# EAGLE design TangPrimer_base (EAGLE 7.7.0)
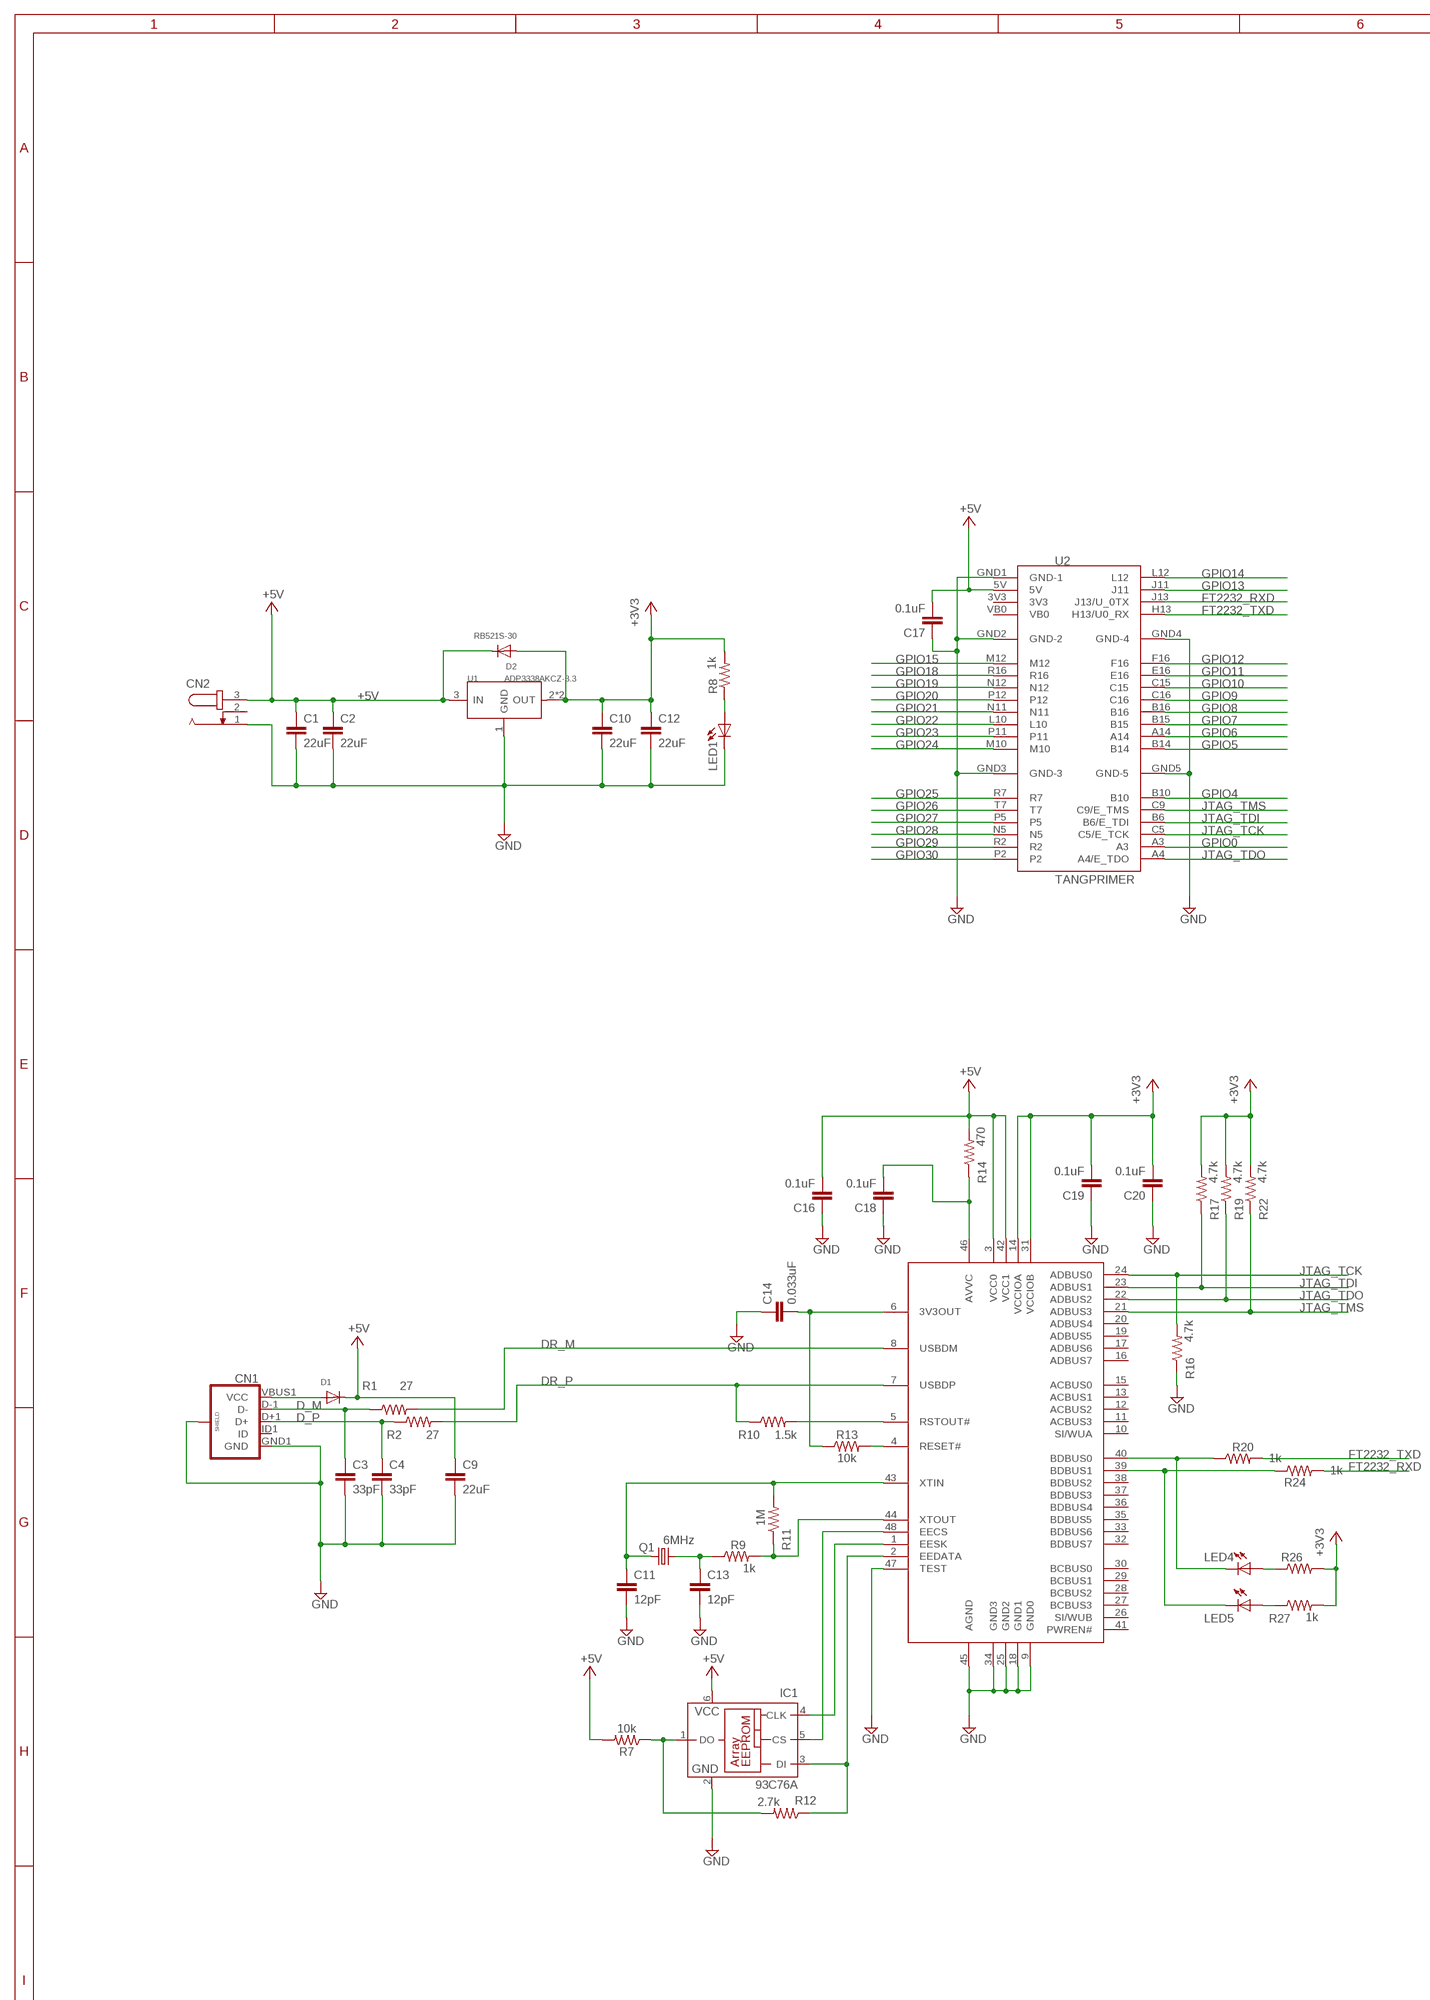
[diagram p0: schematic, sheet 1, part 1 of 2]
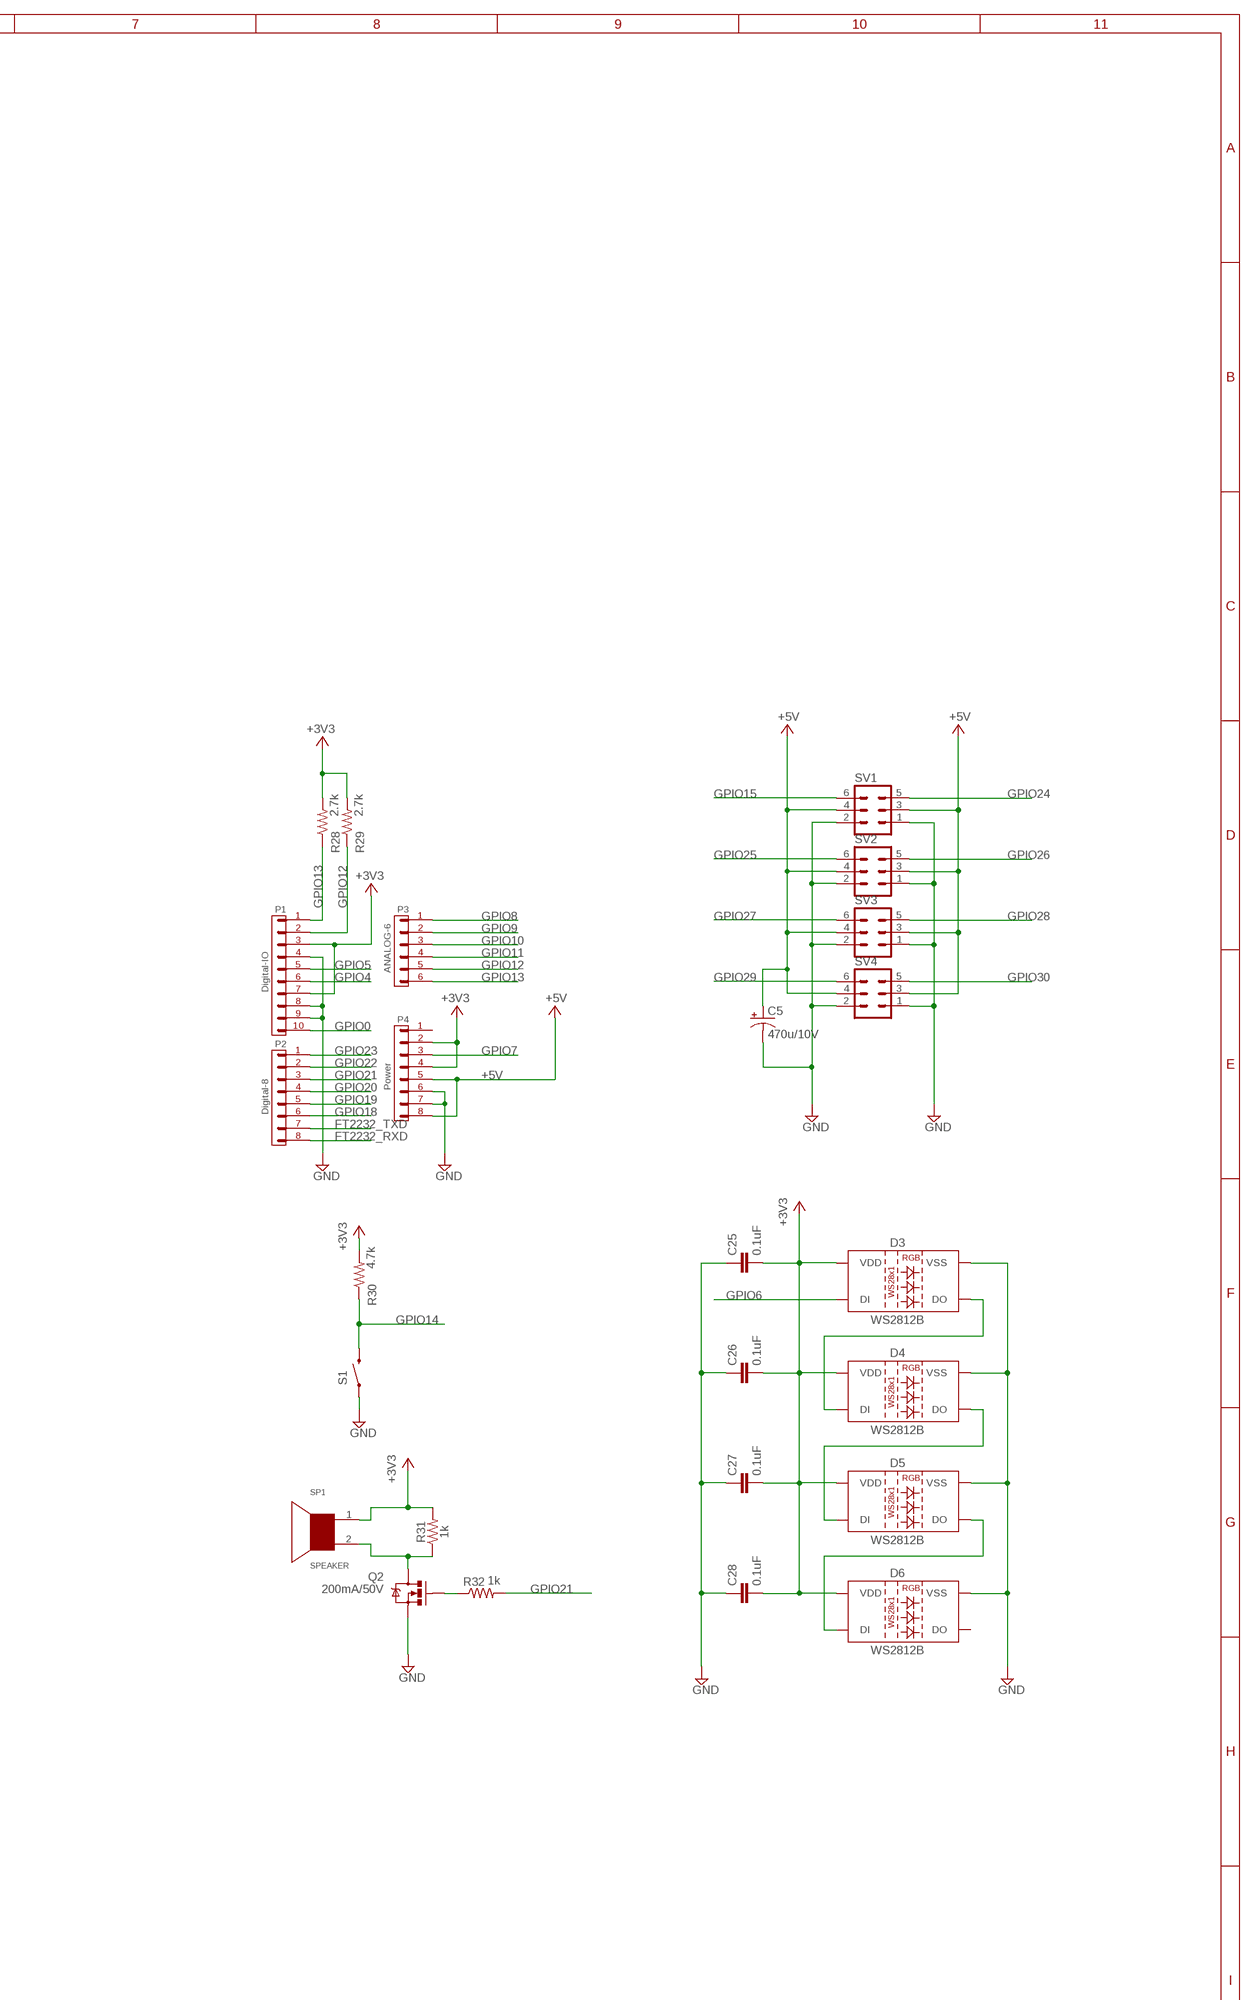
[diagram p1: schematic, sheet 1, part 2 of 2]

## Parts
C1  22uF  10UF-0603-6.3V-20%  [0603]
C2  22uF  10UF-0603-6.3V-20%  [0603]
C3  33pF  47PF-0603-50V-5%  [0603]
C4  33pF  47PF-0603-50V-5%  [0603]
C5  470u/10V  CPOL-USE2.5-7  [E2,5-7]
C9  22uF  10UF-0603-6.3V-20%  [0603]
C10  22uF  10UF-0603-6.3V-20%  [0603]
C11  12pF  47PF-0603-50V-5%  [0603]
C12  22uF  10UF-0603-6.3V-20%  [0603]
C13  12pF  47PF-0603-50V-5%  [0603]
C14  0.033uF  47PF-0603-50V-5%  [0603]
C16  0.1uF  0.1UF-0603-25V-5%  [0603]
C17  0.1uF  0.1UF-0603-25V-5%  [0603]
C18  0.1uF  0.1UF-0603-25V-5%  [0603]
C19  0.1uF  0.1UF-0603-25V-5%  [0603]
C20  0.1uF  0.1UF-0603-25V-5%  [0603]
C25  0.1uF  0.1UF-0603-25V-5%  [0603]
C26  0.1uF  0.1UF-0603-25V-5%  [0603]
C27  0.1uF  0.1UF-0603-25V-5%  [0603]
C28  0.1uF  0.1UF-0603-25V-5%  [0603]
CN1  MCUBF-09  [MCUBF-09]
CN2  JACK-PLUG0  [SPC4077]
D1  DIODE_SOD-123FL  [SOD-123FL]
D2  RB521S-30  DIODESOD-523  [SOD-523]
D3  WS2812B  WS2812_2020  [WS2812_2020]
D4  WS2812B  WS2812_2020  [WS2812_2020]
D5  WS2812B  WS2812_2020  [WS2812_2020]
D6  WS2812B  WS2812_2020  [WS2812_2020]
IC1  93C76A  [SOT23-6]
IC2  FT2232L  [LQFP48]
LED1  LEDCHIP-LED0805  [CHIP-LED0805]
LED4  LEDCHIP-LED0805  [CHIP-LED0805]
LED5  LEDCHIP-LED0805  [CHIP-LED0805]
Q1  6MHz  CRYSTALSM49  [SM49]
Q2  200mA/50V  MOSFET-NCHANNELBSS138  [SOT23-3]
R1  27  RESISTOR0603  [0603]
R2  27  RESISTOR0603  [0603]
R7  10k  RESISTOR0603  [0603]
R8  1k  RESISTOR0603  [0603]
R9  1k  RESISTOR0603  [0603]
R10  1.5k  RESISTOR0603  [0603]
R11  1M  RESISTOR0603  [0603]
R12  2.7k  RESISTOR0603  [0603]
R13  10k  RESISTOR0603  [0603]
R14  470  RESISTOR0603  [0603]
R16  4.7k  RESISTOR0603  [0603]
R17  4.7k  RESISTOR0603  [0603]
R19  4.7k  RESISTOR0603  [0603]
R20  1k  RESISTOR0603  [0603]
R22  4.7k  RESISTOR0603  [0603]
R24  1k  RESISTOR0603  [0603]
R26  1k  RESISTOR0603  [0603]
R27  1k  RESISTOR0603  [0603]
R28  2.7k  RESISTOR0603  [0603]
R29  2.7k  RESISTOR0603  [0603]
R30  4.7k  RESISTOR0603  [0603]
R31  1k  RESISTOR0603  [0603]
R32  1k  RESISTOR0603  [0603]
S1  SWITCH-MOMENTARY-2SMD-1101NE  [TACTILE-SWITCH-1101NE]
S2  TANGPRIMER_BASE  [TANGPRIMER_BASE]
SP1  SPEAKER  [SPEAKER]
SV1  MA03-2  [MA03-2]
SV2  MA03-2  [MA03-2]
SV3  MA03-2  [MA03-2]
SV4  MA03-2  [MA03-2]
U1  ADP3338AKCZ-3.3  PMIC-CJT1117-3.3(SOT223)  [SOT-223]
U2  TANGPRIMER  [TANGPRIMER]

## Nets
+3V3 [pow]: C10.1 C12.1 C19.2 C20.2 C25.2 C26.2 C27.2 C28.2 D2.A D3.4(VDD) D4.4(VDD) D5.4(VDD) D6.4(VDD) IC2.14(VCCIOA) IC2.31(VCCIOB) R8.2 R17.2 R19.2 R22.2 R26.2 R27.2 R28.2 R29.2 R30.2 R31.2 S2.3V3-1 S2.3V3-2 S2.AREF S2.D11 SP1.1 U1.2(OUT) U1.TER(OUT)
+5V [pow]: C1.1 C2.1 C5.+ C9.1 C16.2 C17.2 CN2.3 D1.C D2.K(C) IC1.6(VCC) IC2.3(VCC0) IC2.42(VCC1) R7.2 R14.2 S2.5V S2.VIN SV1.3 SV1.4 SV2.3 SV2.4 SV3.3 SV3.4 SV4.3 SV4.4 U1.3(IN) U2.5V
D_M: C3.1 CN1.D-1(D-) R1.1
D_P: C4.1 CN1.D+1(D+) R2.1
DR_M: IC2.8(USBDM) R1.2
DR_P: IC2.7(USBDP) R2.2 R10.1
FT2232_RXD: R24.2 S2.RXD(RX) U2.J13(J13/U_0TX)
FT2232_TXD: R20.2 S2.TXD(TX) U2.H13(H13/U0_RX)
GND [GND]: C1.2 C2.2 C3.2 C4.2 C5.- C9.2 C10.2 C11.2 C12.2 C13.2 C14.1 C16.1 C17.1 C18.1 C19.1 C20.1 C25.1 C26.1 C27.1 C28.1 CN1.GND1(GND) CN1.GND@1(SHIELD) CN1.GND@2(SHIELD) CN1.GND@3(SHIELD) CN1.GND@4(SHIELD) CN1.GND@5(SHIELD) CN1.GND@6(SHIELD) CN1.GND@7(SHIELD) CN1.GND@8(SHIELD) CN2.1 D3.2(VSS) D4.2(VSS) D5.2(VSS) D6.2(VSS) IC1.2(GND) IC2.9(GND0) IC2.18(GND1) IC2.25(GND2) IC2.34(GND3) IC2.45(AGND) IC2.47(TEST) LED1.C Q2.2(S) R16.1 S1.1 S2.D9 S2.D10 S2.GND-1(GND1) S2.GND-2(GND2) S2.GND-3(GND3) SV1.1 SV1.2 SV2.1 SV2.2 SV3.1 SV3.2 SV4.1 SV4.2 U1.1(GND) U2.GND1(GND-1) U2.GND2(GND-2) U2.GND3(GND-3) U2.GND4(GND-4) U2.GND5(GND-5)
GPIO0: S2.D8 U2.A3
GPIO4: S2.D12 U2.B10
GPIO5: S2.D13 U2.B14
GPIO6: D3.3(DI) U2.A14
GPIO7: S2.RESET U2.B15
GPIO8: S2.A0 U2.B16
GPIO9: S2.A1 U2.C16
GPIO10: S2.A2 U2.C15
GPIO11: S2.A3 U2.E16
GPIO12: R29.1 S2.A4 S2.SDA U2.F16
GPIO13: R28.1 S2.A5 S2.SCL U2.J11
GPIO14: R30.1 S1.2 U2.L12
GPIO15: SV1.6 U2.M12
GPIO18: S2.D2 U2.R16
GPIO19: S2.D3 U2.N12
GPIO20: S2.D4 U2.P12
GPIO21: R32.2 S2.D5 U2.N11
GPIO22: S2.D6 U2.L10
GPIO23: S2.D7 U2.P11
GPIO24: SV1.5 U2.M10
GPIO25: SV2.6 U2.R7
GPIO26: SV2.5 U2.T7
GPIO27: SV3.6 U2.P5
GPIO28: SV3.5 U2.N5
GPIO29: SV4.6 U2.R2
GPIO30: SV4.5 U2.P2
JTAG_TCK: IC2.24(ADBUS0) R16.2 U2.C5(C5/E_TCK)
JTAG_TDI: IC2.23(ADBUS1) R17.1 U2.B6(B6/E_TDI)
JTAG_TDO: IC2.22(ADBUS2) R19.1 U2.A4(A4/E_TDO)
JTAG_TMS: IC2.21(ADBUS3) R22.1 U2.C9(C9/E_TMS)
N$1 [pow]: CN1.VBUS1(VCC) D1.A
N$3: Q2.3(D) R31.1 SP1.2
N$9: IC2.5(RSTOUT#) R10.2
N$10: Q2.1(G) R32.1
N$11: IC2.4(RESET#) R13.2
N$12: LED1.A R8.1
N$13: C14.2 IC2.6(3V3OUT) R13.1
N$15: C11.1 IC2.43(XTIN) Q1.1 R11.2
N$16: IC2.44(XTOUT) R9.2 R11.1
N$17: C13.1 Q1.2 R9.1
N$22: LED4.A R26.1
N$24: LED5.A R27.1
N$25: IC1.5(CS) IC2.48(EECS)
N$26: IC1.4(CLK) IC2.1(EESK)
N$27: IC1.3(DI) IC2.2(EEDATA) R12.1
N$28: IC1.1(DO) R7.1 R12.2
N$29: D3.1(DO) D4.3(DI)
N$31: IC2.40(BDBUS0) LED4.C R20.1
N$35: D4.1(DO) D5.3(DI)
N$36: C18.2 IC2.46(AVVC) R14.1
N$37: D5.1(DO) D6.3(DI)
N$42: IC2.39(BDBUS1) LED5.C R24.1
Unconnected: CN1.ID1(ID) CN2.2 D6.1(DO) IC2.10(SI/WUA) IC2.11(ACBUS3) IC2.12(ACBUS2) IC2.13(ACBUS1) IC2.15(ACBUS0) IC2.16(ADBUS7) IC2.17(ADBUS6) IC2.19(ADBUS5) IC2.20(ADBUS4) IC2.26(SI/WUB) IC2.27(BCBUS3) IC2.28(BCBUS2) IC2.29(BCBUS1) IC2.30(BCBUS0) IC2.32(BDBUS7) IC2.33(BDBUS6) IC2.35(BDBUS5) IC2.36(BDBUS4) IC2.37(BDBUS3) IC2.38(BDBUS2) IC2.41(PWREN#) S2.RESERVED U2.3V3 U2.VB0

## Library data of the parts
C1 C2 C9 C10 C12 = SparkFun-Capacitors:10UF: 10.0µF ceramic capacitors A capacitor is a passive two-terminal electrical component used to store electrical energy temporarily in an electric field.; PROD_ID: CAP-11015; VALUE: 10uF
C3 C4 C11 C13 C14 = SparkFun-Capacitors:47PF: 47pF ceramic capacitors A capacitor is a passive two-terminal electrical component used to store electrical energy temporarily in an electric field.; PROD_ID: CAP-08913; VALUE: 47pF
C5 = resistor:CPOL-US: POLARIZED CAPACITOR, American symbol
C16-C20 C25-C28 = SparkFun-Capacitors:0.1UF: 0.1µF ceramic capacitors A capacitor is a passive two-terminal electrical component used to store electrical energy temporarily in an electric field.; PROD_ID: CAP-08604
CN1 = MCUBF:MCUBF: USB Micro-B connectors Some male, some female. Watch your step!
CN2 = con-jack:JACK-PLUG: DC POWER JACK Power Jack, DC, Right Angle, Through Hole, Rated 5A at 16VDC, PC Terminals Distributor: Farnell (www.Farnell.de) Drawing: 84N1161.pdf / 84N1162.pdf Manufacturer: SPC Technology (www.spctechnology.com) Type: SPC4077 / SPC 4078; OC_FARNELL: unknown; OC_NEWARK: unknown
D1 D2 = adafruit:DIODE: Diode SMADIODE - SMA Surface Mount Package 20V 1A Schottky Diode Digikey: 641-1014-6-ND DO-1N4148 - Through Hole Small Current Diode SOD-123 20V 1 A (.5mV Vf) Schottky Diode - Digikey: MBRX120TPMSCT-ND SOD-323 10V 570mA (.38mV Vf, 3ns) Schottky Diode - Digikey: ZLLS410CT-ND SOD-523 30V 30mA Schottky Diode (RB751S-40TE61) - Digikey: RB751S-40TE61CT-ND SOT23-R/W - SOT23 Package (R = Solder Paste/Reflow Ovens, W = Hand-Soldering) BAT54Film 40V 300mA - Digikey: 497-7162-1-ND
D3-D6 = ws2812_2020:WS2812_2020: WS2812 2020 SMD addressable RGB LED 2x2mm SMD LED with built-in controller IC.; PROD_ID: DIO-12503
IC1 = microchip:93*76?: 8K Microwire Compatible Serial EEPROM Source: http://ww1.microchip.com/downloads/en/DeviceDoc/21796H.pdf; OC_FARNELL: unknown; OC_NEWARK: unknown
IC2 = ftdichip:FT2232L: USB UART / FIFO Controller 3nd Generation USB Double-UART (USB <-> Serial) - FIFO Controller
LED1 LED4 LED5 = adafruit:LED: LED OSRAM: - CHIPLED LG R971, LG N971, LY N971, LG Q971, LY Q971, LO R971, LY R971 LH N974, LH R974 LS Q976, LO Q976, LY Q976 LO Q996 - Hyper CHIPLED LW Q18S LB Q993, LB Q99A, LB R99A - SideLED LS A670, LO A670, LY A670, LG A670, LP A670 LB A673, LV A673, LT A673, LW A673 LH A674 LY A675 LS A676, LA A676, LO A676, LY A676, LW A676 LS A679, LY A679, LG A679 - Hyper Micro SIDELED® LS Y876, LA Y876, LO Y876, LY Y876 LT Y87S - SmartLED LW L88C, LW L88S LB L89C, LB L89S, LG L890 LS L89K, LO L89K, LY L89K LS L896, LA L896, LO L896, LY L896 - TOPLED LS T670, LO T670, LY T670, LG T670, LP T670 LSG T670, LSP T670, LSY T670, LOP T670, LYG T670 LG T671, LOG T671, LSG T671 LB T673, LV T673, LT T673, LW T673 LH T674 LS T676, LA T676, LO T676, LY T676, LB T676, LH T676, LSB T676, LW T676 LB T67C, LV T67C, LT T67C, LS T67K, LO T67K, LY T67K, LW E67C LS E67B, LA E67B, LO E67B, LY E67B, LB E67C, LV E67C, LT E67C LW T67C LS T679, LY T679, LG T679 LS T770, LO T770, LY T770, LG T770, LP T770 LB T773, LV T773, LT T773, LW T773 LH T774 LS E675, LA E675, LY E675, LS T675 LS T776, LA T776, LO T776, LY T776, LB T776 LHGB T686 LT T68C, LB T68C - Hyper Mini TOPLED® LB M676 - Mini TOPLED Santana® LG M470 LS M47K, LO M47K, LY M47K Source: http://www.osram.convergy.de/
Q1 = crystal:CRYSTAL: CRYSTAL; OC_FARNELL: unknown; OC_NEWARK: unknown
Q2 = SparkFun-DiscreteSemi:MOSFET-NCHANNEL: Common NMOSFET Parts MFG P/N Store ID Prod ID FDD8780 TRANS-09984 SI7820DN TRANS-11055 FDS6630A IC-08089 2N7002PW TRANS-11151 FQP30N06L COM-10213 TRANS-10060 BSS123LT1G TRANS-08345 BSS138 TRANS-00830 BS170 2N7000; PROD_ID: TRANS-00830
R1 R2 R7-R14 R16 R17 R19 R20 R22 R24 R26-R32 = SparkFun-Resistors:RESISTOR: Generic Resistor Package
S1 = SparkFun-Electromechanical:SWITCH-MOMENTARY-2: Various NO switches- pushbuttons, reed, etc; PROD_ID: SWCH-00815
S2 = suna_lib:TANGPRIMER_BASE
SP1 = cq:SPEAKER
SV1-SV4 = con-lstb:MA03-2: PIN HEADER; OC_FARNELL: unknown; OC_NEWARK: unknown
U1 = Seeed-OPL-ic:PMIC-CJT1117-3.3(SOT223): 310030097; MPN: CJT1117-3.3; VALUE: CJT1117-3.3-SOT223
U2 = suna_lib:TANGPRIMER

## Net classes
1 pow: width 0.406 mm
2 GND: width 0.61 mm

## Board
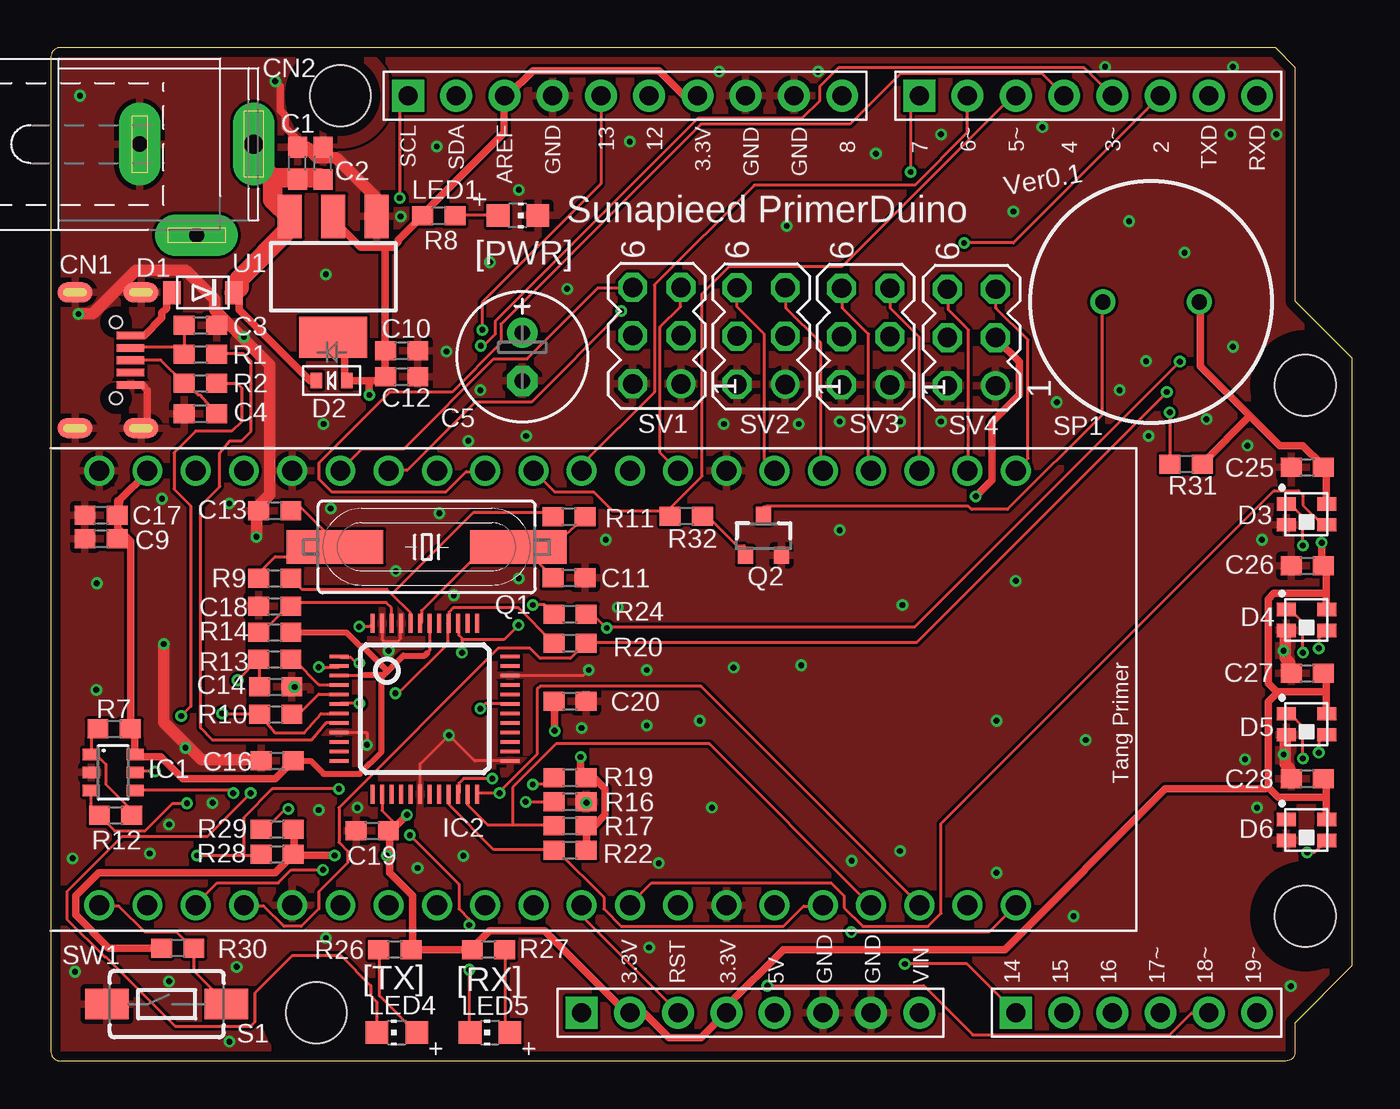
[diagram p2: board, top side]
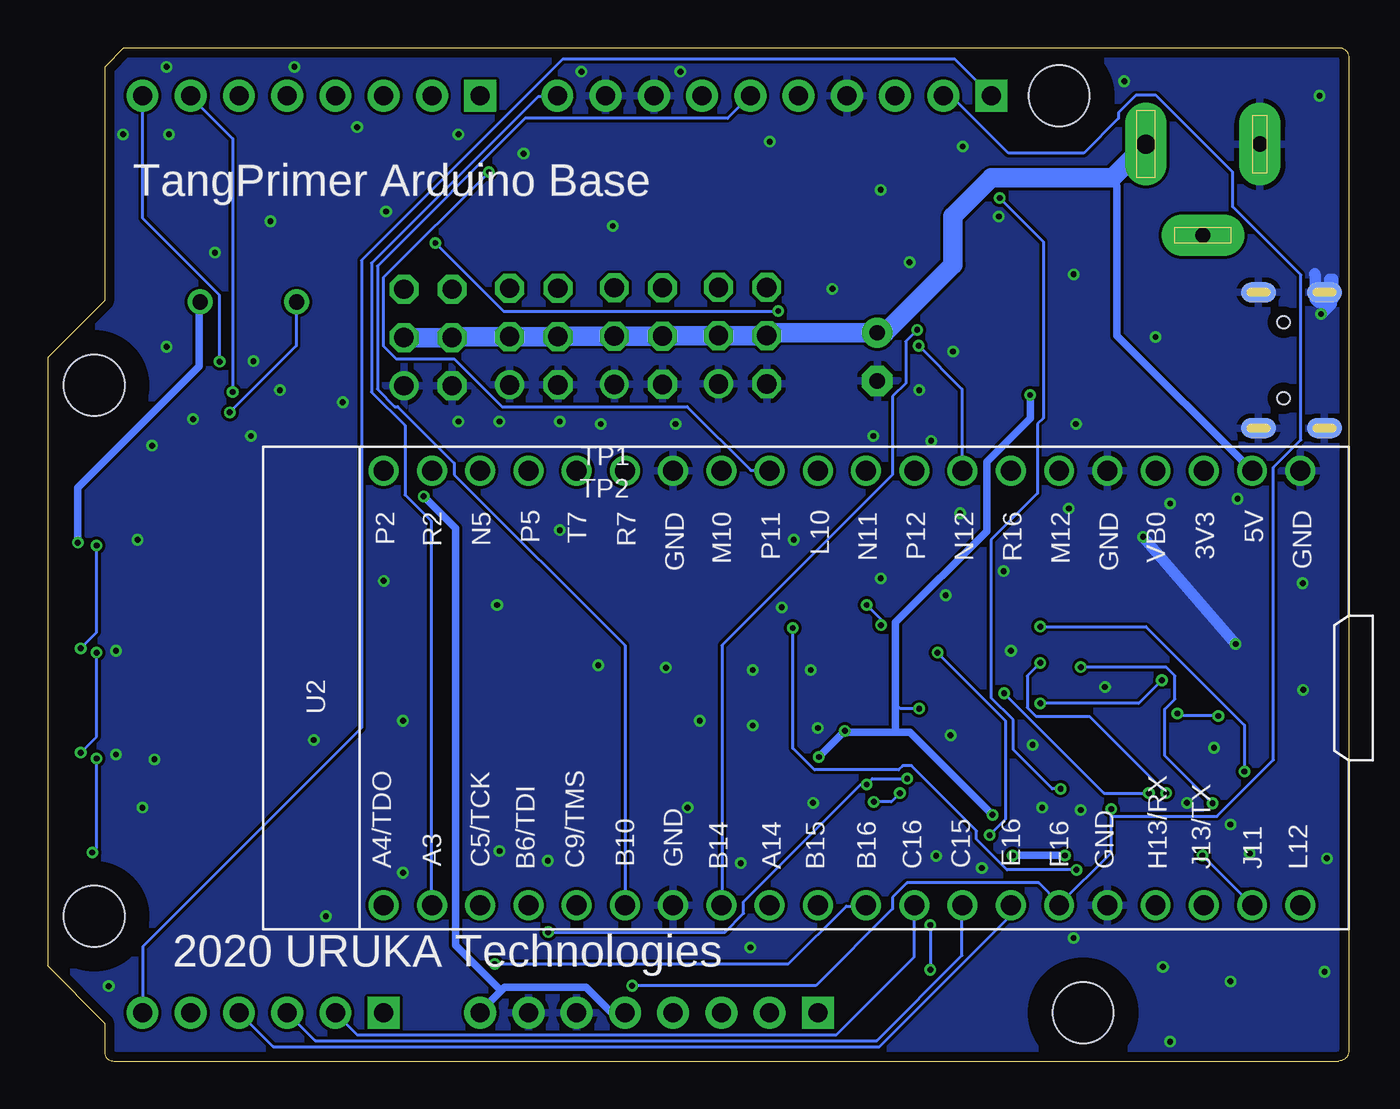
[diagram p3: board, bottom side, seen from below]

Size 68.5 x 53.34 mm. Coordinates in mm from the lower left corner, seen from the top.
Copper layers (1*16): Top 0.035mm / dielectric 1.53mm / Bottom 0.035mm
Design rules "seeed_pban_5mil": minimum track width 6mil, minimum drill 12mil, track to track 6mil, track to pad 0.229mm, pad to pad 6mil, via to via 6mil, smd to smd 5mil, copper to edge 0.5mm, drill to drill 0.5mm, minimum pad ring 10mil, minimum via ring 6mil, stop-mask expansion 4mil, vias tented up to drill 25mil, thermal gap 10mil

### Footprints (pad centres in the part's own frame; a part is rotated, then mirrored left to right if it is on the bottom)
0603 = smd 1.1 x 1: 1 -0.85,0; 2 0.85,0
E2,5-7 = drill 0.813 pad 1.6: + -1.27,0 | drill 0.813 pad 1.6 octagon: - 1.27,0
MCUBF-09 = smd 1.45 x 0.4: D+1 1.455,0; D-1 1.455,0.65; GND1 1.455,-1.3; ID1 1.455,-0.65; VBUS1 1.455,1.3 | smd 1.85 x 1.05: GND@1 -1.475,3.575; GND@2 2,3.575; GND@3 -1.475,-3.575; GND@4 2,-3.575 | smd 1.85 x 1.05 bottom: GND@5 -1.475,3.575; GND@6 2,3.575; GND@7 -1.475,-3.575; GND@8 2,-3.575 | hole 0.65: 0.68,2; 0.68,-2
SPC4077 = drill 0.8 pad 2.184 long: 1 -3,0; 2 0,-4.8 | drill 1 pad 2.184 long: 3 3,0
SOD-123FL = smd 0.91 x 1.22: A 1.637,0; C -1.637,0
SOD-523 = smd 0.8 x 0.6: A 0,-0.8; K 0,0.8
WS2812_2020 = smd 1 x 0.7: 1 0.565,-0.9; 2 0.565,0.2; 3 -1.565,0.2; 4 -1.565,-0.9
SOT23-6 = smd 0.6 x 0.9: 1 -0.95,-1.15; 2 0,-1.15; 3 0.95,-1.15; 4 0.95,1.15; 5 0,1.15; 6 -0.95,1.15
LQFP48 = smd 0.2 x 1: 1 -2.75,-4.5; 2 -2.25,-4.5; 3 -1.75,-4.5; 4 -1.25,-4.5; 5 -0.75,-4.5; 6 -0.25,-4.5; 7 0.25,-4.5; 8 0.75,-4.5; 9 1.25,-4.5; 10 1.75,-4.5; 11 2.25,-4.5; 12 2.75,-4.5; 25 2.75,4.5; 26 2.25,4.5; 27 1.75,4.5; 28 1.25,4.5; 29 0.75,4.5; 30 0.25,4.5; 31 -0.25,4.5; 32 -0.75,4.5; 33 -1.25,4.5; 34 -1.75,4.5; 35 -2.25,4.5; 36 -2.75,4.5 | smd 1 x 0.2: 13 4.5,-2.75; 14 4.5,-2.25; 15 4.5,-1.75; 16 4.5,-1.25; 17 4.5,-0.75; 18 4.5,-0.25; 19 4.5,0.25; 20 4.5,0.75; 21 4.5,1.25; 22 4.5,1.75; 23 4.5,2.25; 24 4.5,2.75; 37 -4.5,2.75; 38 -4.5,2.25; 39 -4.5,1.75; 40 -4.5,1.25; 41 -4.5,0.75; 42 -4.5,0.25; 43 -4.5,-0.25; 44 -4.5,-0.75; 45 -4.5,-1.25; 46 -4.5,-1.75; 47 -4.5,-2.25; 48 -4.5,-2.75
CHIP-LED0805 = smd 1.2 x 1.2: A 0,-1.05; C 0,1.05
SM49 = smd 5.08 x 1.778: 1 -4.826,0; 2 4.826,0
SOT23-3 = smd 0.8 x 0.9: 1 -0.95,-1; 2 0.95,-1; 3 0,1.1
TACTILE-SWITCH-1101NE = smd 2.3 x 1.6: 1 -3.15,0; 2 3.15,0
TANGPRIMER_BASE = drill 1 pad 1.676: 3V3-1 30.48,2.54; 3V3-2 35.56,2.54; 5V 38.1,2.54; A1 53.34,2.54; A2 55.88,2.54; A3 58.42,2.54; A4 60.96,2.54; A5 63.5,2.54; AREF 23.876,50.8; D2 58.42,50.8; D3 55.88,50.8; D4 53.34,50.8; D5 50.8,50.8; D6 48.26,50.8; D8 41.656,50.8; D9 39.116,50.8; D10 36.576,50.8; D11 34.036,50.8; D12 31.496,50.8; D13 28.956,50.8; GND-1 40.64,2.54; GND-2 43.18,2.54; GND-3 26.416,50.8; RESET 33.02,2.54; RXD 63.5,50.8; SDA 21.336,50.8; TXD 60.96,50.8; VIN 45.72,2.54 | drill 1 pad 1.676 square: A0 50.8,2.54; D7 45.72,50.8; RESERVED 27.94,2.54; SCL 18.796,50.8 | hole 3.2: 66.04,35.56; 66.04,7.62; 13.97,2.54; 15.24,50.8
SPEAKER = drill 0.8: 1 -2.54,0; 2 2.54,0
MA03-2 = drill 1.016: 1 -2.54,-1.27 | drill 1.016 octagon: 2 -2.54,1.27; 3 0,-1.27; 4 0,1.27; 5 2.54,-1.27; 6 2.54,1.27
SOT-223 = smd 1.27 x 2.286: 1 -2.286,-3.175; 2 0,-3.175; 3 2.286,-3.175 | smd 3.556 x 2.159: TER 0,3.175
TANGPRIMER = drill 1.05: 3V3 -11.43,19.05; 5V -11.43,21.59; A3 11.43,-21.59; A4 11.43,-24.13; A14 11.43,-3.81; B6 11.43,-16.51; B10 11.43,-11.43; B14 11.43,-6.35; B15 11.43,-1.27; B16 11.43,1.27; C5 11.43,-19.05; C9 11.43,-13.97; C15 11.43,6.35; C16 11.43,3.81; E16 11.43,8.89; F16 11.43,11.43; GND1 -11.43,24.13; GND2 -11.43,13.97; GND3 -11.43,-8.89; GND4 11.43,13.97; GND5 11.43,-8.89; H13 11.43,16.51; J11 11.43,21.59; J13 11.43,19.05; L10 -11.43,-1.27; L12 11.43,24.13; M10 -11.43,-6.35; M12 -11.43,11.43; N5 -11.43,-19.05; N11 -11.43,1.27; N12 -11.43,6.35; P2 -11.43,-24.13; P5 -11.43,-16.51; P11 -11.43,-3.81; P12 -11.43,3.81; R2 -11.43,-21.59; R7 -11.43,-11.43; R16 -11.43,8.89; T7 -11.43,-13.97; VB0 -11.43,16.51

### Placement (x,y rotation side)
C1  12.98,47.24 90 top
C2  14.33,47.24 90 top
C3  7.87,38.71 0 top
C4  7.87,34.06 180 top
C5  24.82,37.06 270 top
C9  2.64,27.48 180 top
C10  18.47,37.39 0 top
C11  27.28,25.43 0 top
C12  18.47,36.02 0 top
C13  11.79,28.96 180 top
C14  11.84,19.68 180 top
C16  11.91,15.8 0 top
C17  2.64,28.73 0 top
C18  11.79,23.93 0 top
C19  16.92,12.12 0 top
C20  27.33,18.92 180 top
C25  66.15,31.24 0 top
C26  66.15,26.06 0 top
C27  66.15,20.4 0 top
C28  66.15,14.86 0 top
CN1  2.74,36.88 0 top
CN2  7.67,48.26 0 top
D1  8,40.44 180 top
D2  14.78,35.81 90 top
D3  65.6,28.42 180 top
D4  65.6,22.86 180 top
D5  65.6,17.37 180 top
D6  65.6,11.81 180 top
IC1  3.28,15.19 270 top
IC2  19.68,18.54 270 top
LED1  24.59,44.5 270 top
LED4  18.21,1.5 90 top
LED5  23.11,1.5 90 top
Q1  19.79,27.05 180 top
Q2  37.52,27.61 0 top
R1  7.87,37.19 0 top
R2  7.87,35.66 0 top
R7  3.33,17.48 0 top
R8  20.42,44.48 180 top
R9  11.79,25.4 0 top
R10  11.84,18.24 0 top
R11  27.28,28.65 0 top
R12  3.4,12.93 0 top
R13  11.79,21.13 0 top
R14  11.79,22.56 0 top
R16  27.33,13.64 180 top
R17  27.33,12.37 0 top
R19  27.33,14.91 0 top
R20  27.33,22 0 top
R22  27.33,11.1 0 top
R24  27.33,23.52 0 top
R26  18.11,5.87 0 top
R27  23.04,5.87 180 top
R28  11.91,10.87 0 top
R29  11.91,12.19 0 top
R30  6.68,5.94 180 top
R31  59.77,31.42 0 top
R32  33.45,28.68 180 top
S1  6.1,3 0 top
S2  0,0 0 top
SP1  57.92,39.95 180 top
SV1  31.9,38.18 90 top
SV2  37.39,38.15 90 top
SV3  42.9,38.13 90 top
SV4  48.46,38.07 90 top
U1  14.86,41.27 180 top
U2  26.67,19.63 270 bottom

### Tracks (layer width: path | path; a pad name or v marks a point on that pad's centre or on a via)
+3V3  (via drill 0.3)
  Top 0.152: IC2.31 22.86,18.79 v22.61,18.54 | IC2.14 17.43,13.17 18.2,12.41
  Top 0.406: 67.13,13.87 67.13,14.78 67.06,14.86 C28.2 | 67.13,13.87 67.13,12.72 D6.4 | 67.13,19.43 67.13,20.27 67.06,20.34 C27.2 | 67.13,19.43 67.13,18.29 D5.4 | 67.13,24.61 67.13,25.98 67.06,26.06 C26.2 66.9,26.21 v66.9,27.28 | 67.13,24.61 67.13,23.77 D4.4 | 64.54,19.43 67.13,19.43 | 64.54,19.43 64.08,19.89 64.08,24.31 64.39,24.61 67.13,24.61 | 67.13,13.87 64.62,13.87 64.08,14.4 | 64.08,14.4 64.08,18.9 64.47,19.28 64.54,19.43 | D3.4 67.13,29.34 67.13,31.17 67.06,31.24 C25.2 66.9,31.39 65.91,32.38 64.69,32.38 63.13,33.95 | 60.43,40.01 SP1.1 60.5,39.78 60.5,36.58 63.13,33.95 | 16.76,35.81 17.45,35.81 17.6,35.97 C12.1 17.6,36.2 17.6,37.34 C10.1 17.6,37.57 17.6,42.82 | 16.76,35.81 D2.A 15.47,35.97 15.47,37.49 U1.TER | 17.6,42.82 16.31,42.82 14.86,44.27 U1.2 | 17.6,42.82 17.98,42.82 18.29,43.13 18.29,43.2 19.51,44.42 R8.2 19.66,44.65 23.85,48.84 23.85,50.75 S2.AREF 24.08,50.83 25.38,52.12 32,52.12 33.3,50.83 33.98,50.83 S2.D11 | R30.2 3.05,5.94 1.29,7.7 1.29,8.69 2.52,9.91 11.81,9.91 12.72,10.82 R28.2 | R29.2 12.8,12.19 12.8,11.05 R28.2 | R22.2 28.19,11.12 28.19,12.34 R17.2 28.35,12.42 28.65,12.42 29.18,12.95 29.18,14.33 28.65,14.86 28.19,14.86 R19.2 28.12,15.09 27.89,15.32 v27.89,16 | v26.52,17.37 26.52,18.9 C20.2 | 17.83,10.82 17.83,9.91 19.05,8.69 19.05,6.02 R26.2 R27.2 22.25,6.02 23.09,6.86 25.98,6.86 30.18,2.67 30.33,2.67 S2.3V3-1 30.48,2.52 31.24,2.52 32.54,1.22 34.21,1.22 35.51,2.52 S2.3V3-2 35.59,2.74 35.59,2.9 38.56,5.87 50.22,5.87 58.67,14.33 63.93,14.33 64.08,14.4 | 17.83,10.82 17.83,12.12 C19.2 17.98,12.19 18.2,12.41 v18.75,12.95 | v14.94,10.82 12.95,10.82 R28.2
  Top 0.406: v17.68,10.82 17.83,10.82 | v16.76,35.05 16.76,35.81 | 63.13,33.95 60.66,31.47 R31.2
  Bottom 0.152: v22.61,18.54 23.6,18.54 23.85,18.8
  Bottom 0.406: v66.9,27.28 66.9,30.18 60.5,36.58 60.5,39.93 SP1.1 | v27.89,16 v26.52,17.37 26.36,17.3 23.85,17.3 | 23.85,17.3 23.09,17.3 v18.75,12.95 | v17.68,10.82 v14.94,10.82 | v16.76,35.05 16.76,33.83 19.05,31.55 19.05,27.89 23.85,23.09 23.85,18.8 23.85,17.3
+5V  (via drill 0.3)
  Top 0.152: IC2.42 19.93,21.59 19.81,21.46 | IC2.3 16.48,20.29 16.51,20.32
  Top 0.305: C16.2 13.66,15.8 14.35,15.11 16.26,15.11 17.4,16.26 17.4,20.19 17.53,20.32 | 17.53,20.32 17.72,20.51 | 17.72,20.51 18.54,21.34 19.68,21.34 19.81,21.46 | 16.51,20.32 17.53,20.32 | R14.2 15.54,22.55 16.26,21.84 16.38,21.84 17.72,20.51
  Top 0.406: D2.K 13.64,35.81 9.91,39.55 9.91,40.01 D1.C | 5.11,31.01 U2.5V 5.03,30.94 3.66,29.57 C17.2 3.5,29.49 3.5,28.27 C9.1 3.5,28.04 4.19,27.36 4.19,17.68 R7.2 4.19,17.45 4.42,17.22 4.42,16.15 IC1.6 4.57,16 5.79,16 6.93,14.86 11.81,14.86 12.72,15.77 C16.2 | v48.69,29.72 49.53,30.56 49.53,33.6 50.98,35.05 50.98,36.8 49.76,38.02 SV4.3
  Top 1.016: CN2.3 10.67,47.49 11.68,46.48 | 11.68,46.48 13.14,46.48 | C2.1 14.16,46.48 13.14,46.48 | 13.14,46.48 C1.1 | 11.68,46.48 11.68,45.34 U1.3 12.57,43.81 9.91,41.15 9.91,40.7 D1.C
  Bottom 0.406: 44.62,3.7 45.72,2.59 S2.VIN | 44.62,3.7 44.42,3.89 40.16,3.89 38.86,2.59 38.1,2.59 S2.5V | U2.5V 12.19,38.18 12.19,46.02 12.45,46.48 | 44.62,3.7 47.02,6.1 47.02,28.04 v48.69,29.72
  Bottom 1.016: CN2.3 12.45,46.48 18.8,46.48 20.83,44.45 20.83,41.91 24.41,38.33 C5.+ 30.48,38.33 SV1.4 SV1.3 36.09,38.18 SV2.4 SV2.3 41.6,38.15 SV3.4 SV3.3 47.14,38.12 SV4.4 SV4.3
D_M
  Top 0.152: 7.01,37.57 C3.1 | 7.01,37.57 R1.1 7.01,37.57 | 7.01,37.57 4.27,37.57 CN1.D-1
D_P
  Top 0.152: CN1.D+1 5.79,36.88 R2.1 | R2.1 | R2.1 7.75,35.05 7.86,35.05 C4.1
DR_M
  Top 0.152: IC2.8 14.49,17.79 13.72,16.89 8.51,16.89 7.87,17.53 7.87,29.21 8.89,30.23 8.89,32 9.4,32.64 10.03,32.64 10.54,33.15 10.54,36.83 10.16,37.21 8.75,37.21 R1.2
DR_P  (via drill 0.3)
  Top 0.152: R2.2 9.8,35.66 10.03,35.43 10.03,33.66 9.53,33.15 7.62,33.15 6.48,32 6.48,30.1 7.37,29.21 7.37,18.67 v6.86,18.16 | v9.02,18.29 11.06,18.29 R10.1 11.11,18.1 11.81,17.27 13.34,17.27 14.22,18.29 IC2.7
  Bottom 0.152: v6.86,18.16 8.89,18.16 v9.02,18.29
FT2232_RXD  (via drill 0.3)
  Top 0.152: v14.33,10.06 12.65,10.06 11.96,9.37 8.76,9.37 7.62,8.23 U2.J13 | R24.2 28.19,23.47 28.57,23.47 v29.26,22.78 29.26,22.86 45.49,22.86 v59.44,36.8
  Bottom 0.152: v29.26,22.78 29.26,16.46 28.12,15.32 23.7,15.32 23.47,15.54 23.01,15.54 19.58,12.12 19.58,11.66 17.98,10.06 v14.33,10.06 | v59.44,36.8 59.44,40.31 63.48,44.35 63.48,50.75 S2.RXD
FT2232_TXD  (via drill 0.3)
  Top 0.152: v58.75,35.2 45.57,22.02 28.19,22.02 R20.2 28.12,21.95 27.36,21.18 25.76,21.18 25.22,21.72 23.55,21.72 15.16,13.34 15.16,11.51 15.62,11.05 15.62,10.44 14.1,8.91 14.1,8 13.18,7.09 12.27,7.09 11.2,8.15 10.21,8.15 U2.H13
  Bottom 0.152: v58.75,35.2 58.75,48.54 60.96,50.75 S2.TXD
GND  (via drill 0.3)
  Top 0.152: IC2.25 22.31,15.79 v20.95,17.14 19.43,15.62 IC2.18 19.43,15.24 | IC2.34 28.04,20.29 v28.32,20.57 | IC2.47 17.43,22.19 17.53,22.1 18.29,22.1 18.41,22.23 18.41,23.02 IC2.45 | IC2.9 16.62,17.29 16.64,17.27 v16.64,16.64 | 14.02,47.55 14.02,47.79 C2.2
  Top 0.406: CN1.GND1 4.8,35.58 5.08,35.31 5.08,33.64 CN1.GND@8 | C1.2 12.98,48.49 12.32,49.15 12.32,49.78 12.06,50.04 12.06,51.31 v11.81,51.56
  Top 0.61: U1.1 17.14,45.41 15.01,47.55 14.02,47.55 13.49,48.08 13.03,48.08 C1.2 | C27.1 65.23,20.42 65.23,20.95 65,21.18 65,22.63 D4.2 | C28.1 65.23,14.86 65.23,15.39 65,15.62 65,17.14 D5.2 | v1.45,39.32 2.21,39.32 4.5,41.6 7.09,41.6 8.61,40.08 8.61,39.55 11.51,36.65 11.51,29.79 10.97,29.26 C13.2 10.82,28.96 v10.82,27.58 | v5.94,21.95 5.94,17.83 7.92,15.85 11.05,15.85 C16.1
  Bottom 0.61: 4.5,47.4 4.67,47.4 | v1.45,39.32 0.91,39.85 0.91,39.93 1.6,39.93 1.75,40.08 1.68,40.16 1.6,40.08 0.99,40.08 0.99,41.15 0.84,41.15 0.84,40.08 0.91,40.01 1.6,40.01 1.75,40.16 1.75,41.3 1.78,41.44 | v5.94,21.95 v10.82,27.58
  other vias: 1.52,50.8 62.23,52.32 55.5,52.32 64.52,48.77 62.1,48.77 52.2,49.15 50.67,44.7 59.69,42.55 62.23,37.59 56.77,44.2 52.96,34.67 60.83,33.78 62.99,32.38 57.78,32.89 56.26,35.31 57.66,36.83 63.75,27.43 64.9,21.59 64.9,16.13 62.87,15.88 54.48,16.89 63.5,13.34 65.28,3.94 53.85,7.62 49.78,9.91 49.78,17.91 44.7,11.05 42.16,10.54 50.8,25.27 39.5,20.83 44.83,24 41.53,27.94 31.37,20.57 31.37,17.65 34.16,17.91 35.94,20.7 28.19,13.59 24.64,25.4 20.45,28.83 18.16,25.78 32,10.41 34.8,13.34 21.72,10.79 16.13,13.34 14.1,13.21 14.48,6.48 9.78,4.95 6.22,4.19 5.21,10.92 1.14,10.67 1.27,4.7 9.4,1.02 31.5,5.97 2.41,25.15 5.84,29.59 14.73,29.08 14.35,33.53 10.16,38.1 14.48,41.4 20.83,37.34 23.11,42.04 43.43,47.75 38.73,43.94 27.18,40.64 20.32,48.13 7.09,16.48 17.78,21.59 27.94,17.53 19.3,10.16 21.21,24.51 9.4,29.34 8.51,13.59 6.22,12.45 2.39,19.53 12.83,19.68 18.41,44.45 24.64,45.85 30.48,48.39 46.86,48.77 40.39,52.07 35.18,52.07 46.86,33.66 44.7,33.66 41.53,33.66 39.37,33.53 35.43,33.53 21.97,32.64 22.61,35.31 25.02,32.89 29.21,27.43 29.84,23.88
  pour Bottom: 0,53.34 68.58,53.34 68.58,0 0,0
  pour Top: 0,53.34 68.58,53.34 68.58,0 0,0
GPIO0
  Bottom 0.152: U2.A3 48.31,8.23 48.31,28.42 49.68,29.79 49.68,33.45 51.44,35.2 51.44,41.99 42.67,50.75 41.68,50.75 S2.D8
GPIO4
  Bottom 0.152: U2.B10 38.1,21.87 47.09,30.86 47.09,31.47 50.06,34.44 50.22,34.44 51.13,35.36 51.13,41.83 43.36,49.61 32.69,49.61 S2.D12
GPIO5  (via drill 0.3)
  Top 0.152: v22.71,38.48 22.71,39.93 28.96,46.18 S2.D13
  Bottom 0.152: v22.71,38.48 23.32,37.87 23.32,35.66 24,34.98 24,30.86 32.99,21.87 32.99,8.23 U2.B14
GPIO6
  Top 0.152: D3.3 67.13,28.27 66.9,28.27 65.91,29.26 65.91,29.79 65.68,30.02 64.39,30.02 46.86,12.5 46.86,7.77 46.18,7.09 42.75,7.09 41.76,8.08 41.76,8.69 41.07,9.37 31.62,9.37 30.48,8.23 U2.A14
GPIO7
  Top 0.152: U2.B15 27.96,8.15 27.96,7.62 32.99,2.59 S2.RESET
GPIO8  (via drill 0.3)
  Top 0.152: v44.96,5.11 48.23,5.11 S2.A0
  Bottom 0.152: v44.96,5.11 29.49,5.11 26.44,8.15 25.45,8.15 U2.B16
GPIO9
  Bottom 0.152: U2.C16 22.86,5.49 26.98,1.37 52.2,1.37 53.34,2.52 S2.A1
GPIO10
  Bottom 0.152: S2.A2 54.41,1.07 24.84,1.07 20.34,5.56 20.34,8.15 U2.C15
GPIO11
  Bottom 0.152: U2.E16 17.83,8.15 17.83,7.62 24.69,0.76 56.62,0.76 58.37,2.52 S2.A3
GPIO12  (via drill 0.3)
  Top 0.152: v37.72,3.96 45.95,3.96 48.54,1.37 58.9,1.37 60.05,2.52 60.96,2.52 S2.A4 | R29.1 11.28,12.19 12.34,13.26 v12.5,13.26
  Bottom 0.152: v37.72,3.96 28.04,3.96 24,8 24,8.61 23.24,9.37 16.31,9.37 15.24,8.31 15.24,8.23 | 12.5,12.88 12.5,10.97 15.24,8.23 | 12.5,12.88 v12.5,13.26 | 15.24,8.23 U2.F16 | 12.5,12.88 6.93,12.88 3.96,15.85 3.96,31.24 2.52,32.69 2.52,41.38 6.1,44.96 6.1,46.79 10.13,50.83 11.2,50.83 12.12,49.91 12.12,49.61 13.95,47.78 17.91,47.78 20.88,50.75 21.34,50.75 S2.SDA
GPIO13  (via drill 0.3)
  Top 0.152: v7.7,10.82 10.13,10.82 | 10.13,10.82 11.05,10.82 R28.1 | 10.13,10.82 10.13,12.8 11.66,14.33 v15.16,14.33 | v18.36,45.41 18.36,50.37 S2.SCL
  Bottom 0.152: U2.J11 v7.7,10.82 | v18.36,45.41 16.08,43.13 16.08,33.83 16.38,33.53 16.38,29.87 18.82,27.43 18.82,19.13 17.65,17.96 17.65,16.38 15.6,14.33 v15.16,14.33 | S2.SCL 20.73,52.73 41.38,52.73 51.97,42.14 51.97,17.53 63.48,6.02 63.48,2.59 S2.A5
GPIO14
  Top 0.152: S1.2 9.22,3.05 7.54,4.72 7.54,5.94 R30.1 7.47,5.94 6.63,6.78 4.95,6.78 3.58,8.15 2.59,8.15 U2.L12
GPIO15
  Top 0.152: SV1.6 30.63,40.69 28.8,40.69 25.07,36.96 23.32,36.96 18.59,32.23 16.38,32.23 15.24,31.09 U2.M12
GPIO18  (via drill 0.3)
  Top 0.152: v30.02,39.47 30.02,39.4 25.3,34.67 22.33,34.67 18.75,31.09 17.83,31.09 U2.R16 | v48.08,43.05 50.67,43.05 S2.D2
  Bottom 0.152: v30.02,39.47 44.5,39.47 v48.08,43.05
GPIO19  (via drill 0.3)
  Top 0.152: v22.63,37.64 22.78,37.64 23.39,38.25 23.39,38.94 34.06,49.61 39.55,49.61 40.46,50.52 40.46,51.28 41.45,52.27 54.41,52.27 S2.D3
  Bottom 0.152: v22.63,37.64 20.34,35.36 20.34,31.09 U2.N12
GPIO20
  Top 0.152: U2.P12 22.86,31.01 21.87,31.01 20.8,29.95 14.78,29.95 14.1,30.63 14.1,31.47 17.83,35.2 21.11,35.2 23.7,37.8 23.7,38.79 34.21,49.3 42.06,49.3 44.73,51.97 52.2,51.97 53.34,50.83 S2.D4
GPIO21
  Top 0.152: U2.N11 26.52,29.95 28.57,29.95 29.57,28.96 32.54,28.96 R32.2 32.54,29.03 34.29,30.79 34.29,40.39 35.74,41.83 41.68,41.83 50.6,50.75 50.75,50.75 S2.D5
GPIO22
  Top 0.152: U2.L10 27.96,31.09 27.96,31.39 31.77,35.2 31.77,40.84 37.03,46.1 45.49,46.1 48.23,48.84 48.23,50.75 S2.D6
GPIO23  (via drill 0.3)
  Top 0.152: v45.26,46.79 45.26,50.29 45.72,50.75 S2.D7
  Bottom 0.152: v45.26,46.79 50.83,41.22 50.83,37.64 50.14,36.96 47.09,36.96 44.58,34.44 34.82,34.44 31.47,31.09 30.48,31.09 U2.P11
GPIO24
  Top 0.152: U2.M10 32.08,32 32.08,38.63 33.15,39.7 33.15,40.69 SV1.5
GPIO25
  Top 0.152: SV2.6 36.12,39.7 37.57,38.25 37.57,31.62 38.1,31.09 U2.R7
GPIO26
  Top 0.152: U2.T7 40.54,31.17 40.54,37.8 38.71,39.62 38.71,40.69 SV2.5
GPIO27
  Top 0.152: SV3.6 41.68,40.62 41.68,39.62 43.05,38.25 43.05,31.17 43.13,31.09 U2.P5
GPIO28
  Top 0.152: U2.N5 45.72,38.1 44.2,39.62 44.2,40.62 SV3.5
GPIO29
  Top 0.152: SV4.6 47.24,40.62 47.24,39.55 48.31,38.48 48.31,31.09 U2.R2
GPIO30
  Top 0.152: U2.P2 51.44,31.7 51.44,37.95 49.76,39.62 49.76,40.62 SV4.5
JTAG_TCK  (via drill 0.3)
  Top 0.152: 23.58,14.13 25.6,16.15 25.6,19.58 25.76,19.74 34.21,19.74 45.72,8.23 U2.C5 | 23.58,14.13 23.55,14.1 22.48,14.1 IC2.24 | v24.99,13.64 R16.2 | v23.62,14.1 23.58,14.13
  Bottom 0.152: v24.99,13.64 24.08,13.64 v23.62,14.1
JTAG_TDI
  Top 0.152: 24.31,12.42 26.44,12.42 R17.1 | 24.31,12.42 23.01,12.42 21.95,13.49 21.95,14.02 IC2.23 | 24.31,12.42 24.31,14.4 26.59,16.69 34.67,16.69 43.13,8.23 U2.B6
JTAG_TDO  (via drill 0.3)
  Top 0.152: v23.24,14.86 21.72,14.86 21.49,14.63 21.49,14.1 IC2.22 | v25.38,14.55 26.14,14.55 26.44,14.86 R19.1 | v42.14,6.78 49.38,6.78 U2.A4
  Bottom 0.152: v23.24,14.86 25.07,14.86 v25.38,14.55 25.68,14.55 31.85,8.38 31.85,7.77 32.84,6.78 v42.14,6.78
JTAG_TMS
  Top 0.152: IC2.21 20.95,14.02 20.95,13.49 23.32,11.12 26.44,11.12 R22.1 26.52,11.05 26.67,11.05 29.11,8.61 29.11,8 30.02,7.09 38.56,7.09 39.62,8.15 40.62,8.15 U2.C9
N$1
  Top 0.406: CN1.VBUS1 4.91,38.18 5.84,39.12 5.84,39.37 6.1,39.62 6.1,40.17 D1.A
N$3  (via drill 0.3)
  Top 0.152: 37.57,29.18 Q2.3 37.64,29.18 48.31,29.18 48.46,29.03 50.37,29.03 55.32,33.98 55.32,39.85 SP1.2 55.32,39.93 | v58.9,34.14 58.9,31.47 R31.1
  Bottom 0.152: v58.9,34.14 55.4,37.64 55.4,39.93 SP1.2
N$9
  Top 0.152: R10.2 13.03,18.24 14.1,19.3 15.17,19.3 IC2.5
N$10
  Top 0.152: Q2.1 36.5,27.13 36.12,27.13 34.37,28.88 R32.1
N$11
  Top 0.152: IC2.4 15.16,19.81 14.1,19.81 12.8,21.11 12.65,21.11 R13.2
N$12
  Top 0.152: LED1.A 21.34,44.5 R8.1
N$13  (via drill 0.3)
  Top 0.152: v16.23,18.82 15.24,18.82 IC2.6 | v9.83,20.04 10.9,21.11 R13.1 | 10.97,21.18 R13.1 | C14.2 10.99,21.08 R13.1
  Bottom 0.152: v16.23,18.82 11.05,18.82 v9.83,20.04
N$15
  Top 0.152: 24.61,27.28 23.09,27.28 19.51,23.7 19.51,23.09 IC2.43 | C11.1 26.21,25.68 25.57,26.33 | 24.61,27.28 25.57,26.33 | 24.61,27.28 Q1.1 | 25.57,26.33 28.12,28.63 R11.2
N$16
  Top 0.152: 17.95,24.57 17.68,24.84 13.19,24.84 R9.2 | 17.95,24.57 18.9,23.62 18.9,23.09 IC2.44 | 17.95,24.57 22.25,28.88 26.36,28.88 R11.1
N$17
  Top 0.152: C13.1 12.65,29.18 13.11,29.18 14.94,27.36 Q1.2 | 14.63,27.58 Q1.2 | R9.1 10.94,25.67 11.81,26.54 14.45,26.54 Q1.2
N$22
  Top 0.152: R26.1 17.3,5.87 17.3,3.43 19.2,1.52 LED4.A
N$24
  Top 0.152: R27.1 23.93,5.87 23.93,1.75 24.16,1.52 LED5.A
N$25  (via drill 0.3)
  Top 0.152: v5.49,15.24 4.5,15.24 IC1.5 | v16.23,22.86 16.76,22.86 16.92,23.01 IC2.48
  Bottom 0.152: v5.49,15.24 5.49,17.68 10.67,22.86 v16.23,22.86
N$26  (via drill 0.3)
  Top 0.152: v9.6,14.1 9.45,14.25 4.5,14.25 IC1.4 | v16.23,20.95 16.08,20.95 15.77,21.26 15.24,21.26 IC2.1
  Bottom 0.152: v9.6,14.1 13.64,18.14 16.46,18.14 16.92,18.59 16.92,20.27 v16.23,20.95
N$27  (via drill 0.3)
  Top 0.152: IC1.3 2.13,14.17 2.13,13.34 2.52,12.95 R12.1 2.59,12.88 3.35,12.12 4.95,12.12 6.4,13.56 v7.16,13.56 | v14.1,20.73 15.16,20.73 IC2.2
  Bottom 0.152: v14.1,20.73 9.6,20.73 9.14,20.27 9.14,19.05 9.68,18.52 9.68,16.08 v7.16,13.56
N$28
  Top 0.152: R7.1 2.44,17.45 2.13,17.14 2.13,16.15 IC1.1 2.21,16.15 2.36,16.15 2.9,15.62 2.9,14.55 4.19,13.26 4.19,12.95 R12.2
N$29  (via drill 0.3)
  Top 0.152: v65.91,27.13 65.91,28.65 65.3,29.26 65.08,29.26 D3.1 | v66.75,21.72 66.75,22.25 67.13,22.63 D4.3
  Bottom 0.152: v65.91,27.13 65.91,22.55 v66.75,21.72
N$31  (via drill 0.3)
  Top 0.152: R20.1 26.44,22.02 24.61,23.85 21.18,23.85 20.95,23.62 20.95,23.09 IC2.40 20.88,23.01 20.88,21.95 18.29,19.36 v18.14,19.36 | v10.52,14.1 8.23,11.81 3.73,11.81 0.84,8.91 0.84,7.47 2.82,5.49 2.9,5.49 6.55,1.83 10.52,1.83 10.74,2.06 10.74,3.58 12.72,5.56 15.24,5.56 16.84,3.96 16.84,3.43 17.14,3.12 17.14,1.52 LED4.C
  Bottom 0.152: v10.52,14.1 12.88,14.1 v18.14,19.36
N$35  (via drill 0.3)
  Top 0.152: v65.91,21.49 65.91,23.09 65.3,23.7 65.08,23.7 D4.1 | v66.75,16.23 66.75,16.76 67.13,17.14 D5.3
  Bottom 0.152: v65.91,21.49 65.91,17.07 v66.75,16.23
N$36
  Top 0.152: R14.1 11.12,22.55 12.5,23.93 C18.2 12.84,24.13 17.65,24.13 17.93,23.85 IC2.46
N$37  (via drill 0.3)
  Top 0.152: v65.91,15.93 65.91,17.6 65.3,18.21 65.08,18.21 D5.1 | v66.14,10.97 66.52,10.97 67.13,11.58 D6.3
  Bottom 0.152: v65.91,15.93 65.91,11.2 v66.14,10.97
N$42  (via drill 0.3)
  Top 0.152: 21.68,22.21 21.72,22.17 23.85,22.17 v24.61,22.94 | 21.68,22.21 21.49,22.4 21.49,23.01 IC2.39 | v25.38,24 25.98,24 26.44,23.55 R24.1 | v22.02,4.8 22.02,1.52 LED5.C | v22.02,7.16 22.02,7.47 21.49,8 21.49,9.3 v18.9,11.89 | v21.64,21.49 21.64,22.17 21.68,22.21
  Bottom 0.152: v24.61,22.94 24.61,23.24 v25.38,24 | v22.02,7.16 v22.02,4.8 | v18.9,11.89 18.06,12.72 18.06,17.91 v21.64,21.49

### Text on the board
tPlace: 13 | 12 | 3.3V | GND | GND | 6~ | 5~ | 3~ | 8 | 7 | 4 | 2 | Ver0.1 | Sunapieed PrimerDuino | [PWR] | Tang Primer | SW1 | [TX] | [RX] | 14 | 15 | 16 | 17~ | 18~ | 19~
bPlace: TangPrimer Arduino Base | TP1 | TP2 | 2020 URUKA Technologies